# Altium schematic sheet usb_hub.SchDoc
size A4; SheetNumber: 1; SheetTotal: 1; SPICEModelCacheEGWZYWDI: <root> / <DocumentId>EGWZYWDI</DocumentId> / <CacheFrame Number="0"> / <Model Name="fbmh1608_hm101-tv" Kind="CKT"> / <Text>* FBMH1608_HM101-TV     SPICE MODEL  ( General Type ) / *-------------------------------------------------------------------------------------------------------- / * Model Generated by TAIYO YUDEN Corporation (http://www.ty-top.com) / * Version 5.0 / * TAIYO YUDEN Control No. 170913 / * Copyright(c) 2007 TAIYO YUDEN CO.,LTD. All Rights Reserved. / *-------------------------------------------------------------------------------------------------------- / * / * Products Name : Ferrite Bead Inductors / * / * Characteristics : / *     Impedance at 100MHz : 100 Ohm , Impedance at 1GHz : 170 Ohm , / *     DC Resistance(max) : 0.035 Ohm , Rated Current : 2500 mA , / *     Case Size : 1.6 x 0.8 / 0.063 x 0.031 [mm/inch] , Thickness : 0.8 / 0.031 [mm/inch] / *     (Conditions: Temperature = 25 degC , DC Bias Current/Voltage = 0A / 0V) / * / * External Node Assignments : / * / *  1  o---GGG---o  2 / * / *-------------------------------------------------------------------------------------------------------- / .SubCkt FBMH1608_HM101-TV 1 2 / **************************** / Rdc 1 11 0.025 / Ls 11 101 0.014899n / L1 101 121 0.064152u / R1 101 112 2.4759 / C1 112 121 0.69738u / L2 121 131 0.19171u / R2 121 122 81.771 / C2 122 131 312.39p / L3 131 2 0.046771u / R3 131 132 78.704 / C3 132 2 33.978p / Cp 101 2 0.084911p / **************************** / .ends FBMH1608_HM101-TV</Text> / </Model> / </CacheFrame> / </root>
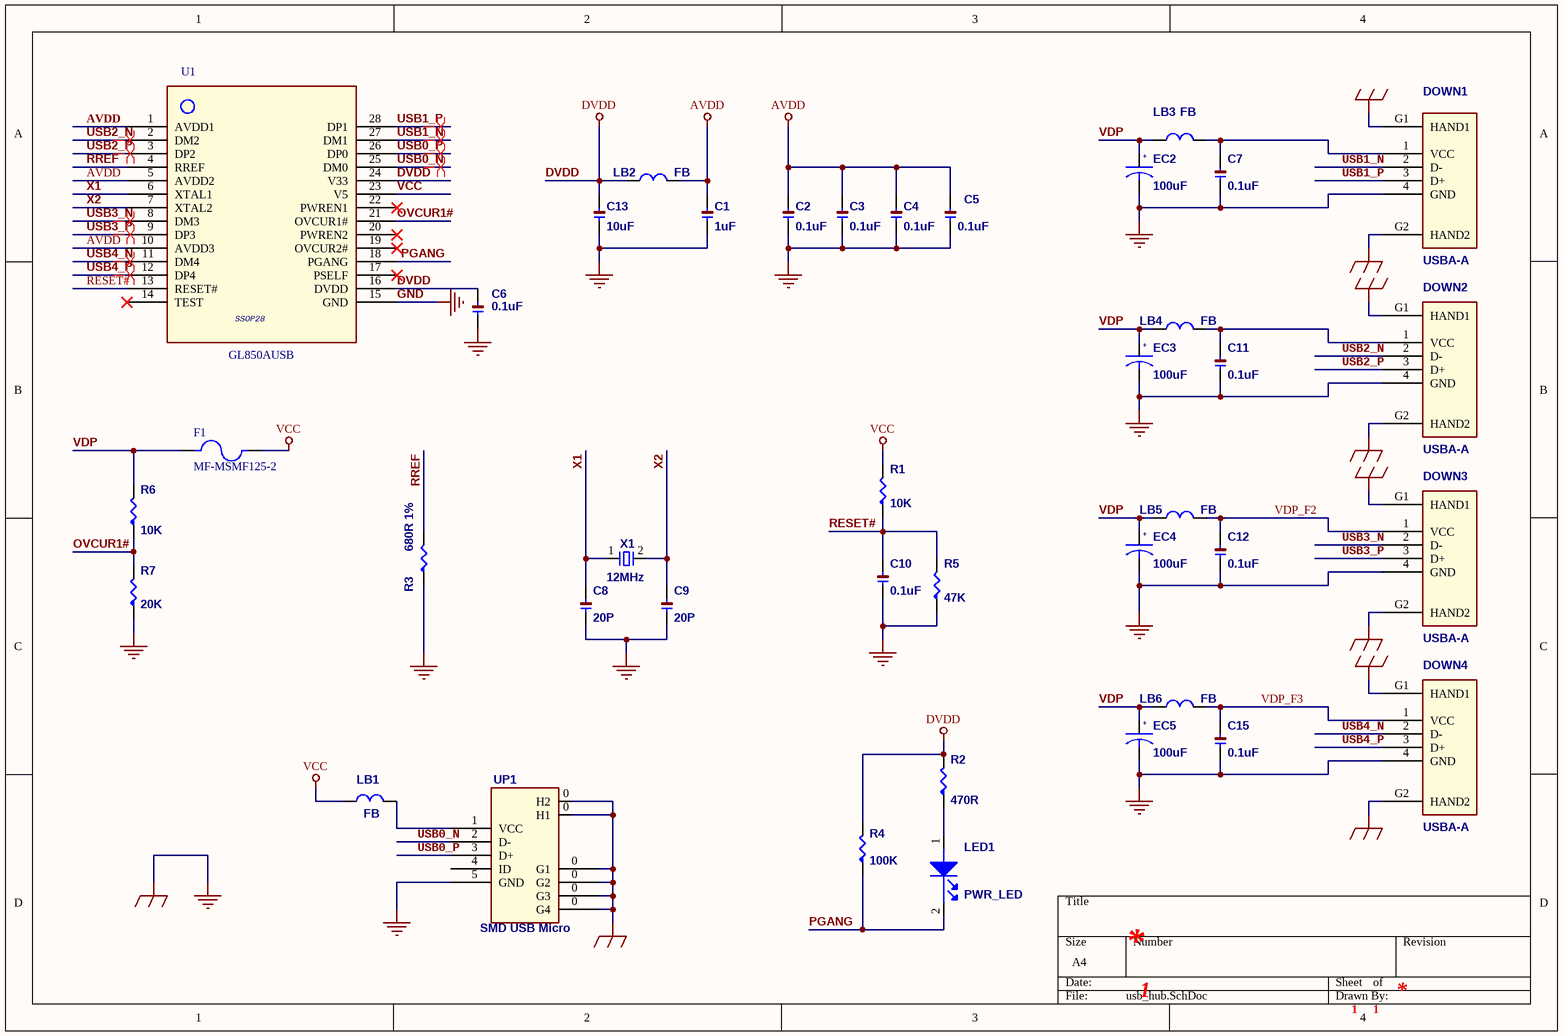
[diagram p0: usb_hub.SchDoc]

## Parts
C1  1uF  [C0603]
C2  0.1uF  [C0603]
C3  0.1uF  [C0603]
C4  0.1uF  [C0603]
C5  0.1uF  [C0603]
C6  0.1uF  [C0603]
C7  0.1uF  [C0603]
C8  20P  [C0603]
C9  20P  [C0603]
C10  0.1uF  [C0603]
C11  0.1uF  [C0603]
C12  0.1uF  [C0603]
C13  10uF  [C0603]
C15  0.1uF  [C0603]
DOWN1  USBA-A  [USBA-A]
DOWN2  USBA-A  [USBA-A]
DOWN3  USBA-A  [USBA-A]
DOWN4  USBA-A  [USBA-A]
EC2  100uF  [CED-6_3-2_5]
EC3  100uF  [CED-6_3-2_5]
EC4  100uF  [CED-6_3-2_5]
EC5  100uF  [CED-6_3-2_5]
F1  MF-MSMF125-2  [FUSER_MF-MSMF125-2]
LB1  FB  [L0805]
LB2  FB  [L0805]
LB3  FB  [L0805]
LB4  FB  [L0805]
LB5  FB  [L0805]
LB6  FB  [L0805]
LED1  PWR_LED  [LED0805]
R1  10K  [R0603]
R2  470R  [R0603]
R3  680R 1%  [R0603]
R4  100K  [R0603]
R5  47K  [R0603]
R6  10K  [R0603]
R7  20K  [R0603]
U1  GL850AUSB  [SSOP28]
UP1  SMD USB Micro  [Micro_USB_MK5P]
X1  12MHz  [XTAL-49SMA-H4.2]

## Nets
AVDD: C1.2 C2.2 C3.2 C4.2 C5.2 LB2.1 U1.1(AVDD1) U1.5(AVDD2) U1.10(AVDD3)
DVDD: C6.2 C13.2 LB2.2 R2.2 R4.2 U1.16(DVDD) U1.24(V33)
GND: C1.1 C2.1 C3.1 C4.1 C5.1 C6.1 C7.1 C8.1 C9.1 C10.1 C11.1 C12.1 C13.1 C15.1 DOWN1.4(GND) DOWN1.G1(HAND1) DOWN1.G2(HAND2) DOWN2.4(GND) DOWN2.G1(HAND1) DOWN2.G2(HAND2) DOWN3.4(GND) DOWN3.G1(HAND1) DOWN3.G2(HAND2) DOWN4.4(GND) DOWN4.G1(HAND1) DOWN4.G2(HAND2) EC2.2 EC3.2 EC4.2 EC5.2 R3.1 R5.1 R7.1 U1.15(GND) UP1.0(G1) UP1.5(GND)
VCC: F1.2 LB1.1 R1.2 U1.23(V5)
OVCUR1#: R6.1 R7.2 U1.21(OVCUR1#)
PGANG: LED1.2 R4.1 U1.18(PGANG)
RESET#: C10.2 R1.1 R5.2 U1.13(RESET#)
RREF: R3.2 U1.4(RREF)
USB0_N: U1.25(DM0) UP1.2(D-)
USB0_P: U1.26(DP0) UP1.3(D+)
USB1_N: DOWN1.2(D-) U1.27(DM1)
USB1_P: DOWN1.3(D+) U1.28(DP1)
USB2_N: DOWN2.2(D-) U1.2(DM2)
USB2_P: DOWN2.3(D+) U1.3(DP2)
USB3_N: DOWN3.2(D-) U1.8(DM3)
USB3_P: DOWN3.3(D+) U1.9(DP3)
USB4_N: DOWN4.2(D-) U1.11(DM4)
USB4_P: DOWN4.3(D+) U1.12(DP4)
VDP: EC2.1 EC3.1 EC4.1 EC5.1 F1.1 LB3.1 LB4.2 LB5.2 LB6.2 R6.2
VDP_F2: C12.2 DOWN3.1(VCC) LB5.1
VDP_F3: C15.2 DOWN4.1(VCC) LB6.1
X1: C8.2 U1.6(XTAL1) X1.1
X2: C9.2 U1.7(XTAL2) X1.2
NetC7_2: C7.2 DOWN1.1(VCC) LB3.2
NetC11_2: C11.2 DOWN2.1(VCC) LB4.1
NetLB1_2: LB1.2 UP1.1(VCC)
NetLED1_1: LED1.1 R2.1

Not connected (* = marked no-connect by the designer): U1 14(TEST)* 17(PSELF)* 19(OVCUR2#)* 20(PWREN2)* 22(PWREN1)*; UP1 4(ID)

## Layout directives
differential pair: USB0_N, USB0_P, USB1_N, USB1_P, USB2_N, USB2_P, USB3_N, USB3_P, USB4_N, USB4_P

## Notes on the sheet
- (in symbol CE-100UF/16V) +
- (in symbol GLI8024-48_3) SSOP28

## Library data of the parts
C1-C13 C15 = C-0603
EC2-EC5 = CE-100UF/16V
F1 = MF-MSMF125-2: Polymeric PTC Resettable Fuse 6V 1.25 A Ih Surface Mount 1812 (4532 Metric), Concave; MF: Bourns; Price: None; SnapEDA_Link: https://www.snapeda.com/parts/MF-MSMF125-2/Bourns/view-part/?ref=snap; Check_prices: https://www.snapeda.com/parts/MF-MSMF125-2/Bourns/view-part/?ref=eda; Purchase-URL: https://pricing.snapeda.com/search/part/MF-MSMF125-2/?ref=eda; Availability: In Stock; Package: 1812 Bourns; MP: MF-MSMF125-2; Value: *
LB1-LB6 = FB-0805
LED1 = LED-3mm_0
R1 R2 R4-R7 = R-0603
  R1 R6: Parameter 1: 10K
  R2: Parameter 1: 470R
  R4: Parameter 1: 100K
  R5: Parameter 1: 47K
  R7: Parameter 1: 20K
R3 = R-0603 1%: Parameter 1: 680R
U1 = GLI8024-48_3
UP1 = CNS-USBminiAB-A
X1 = XD-49US-A